# Altium schematic sheet STM32.SchDoc
size A; SheetNumber: 2; SheetTotal: 2; SPICEModelCachePQSWNAHP: <root> / <DocumentId>PQSWNAHP</DocumentId> / </root>
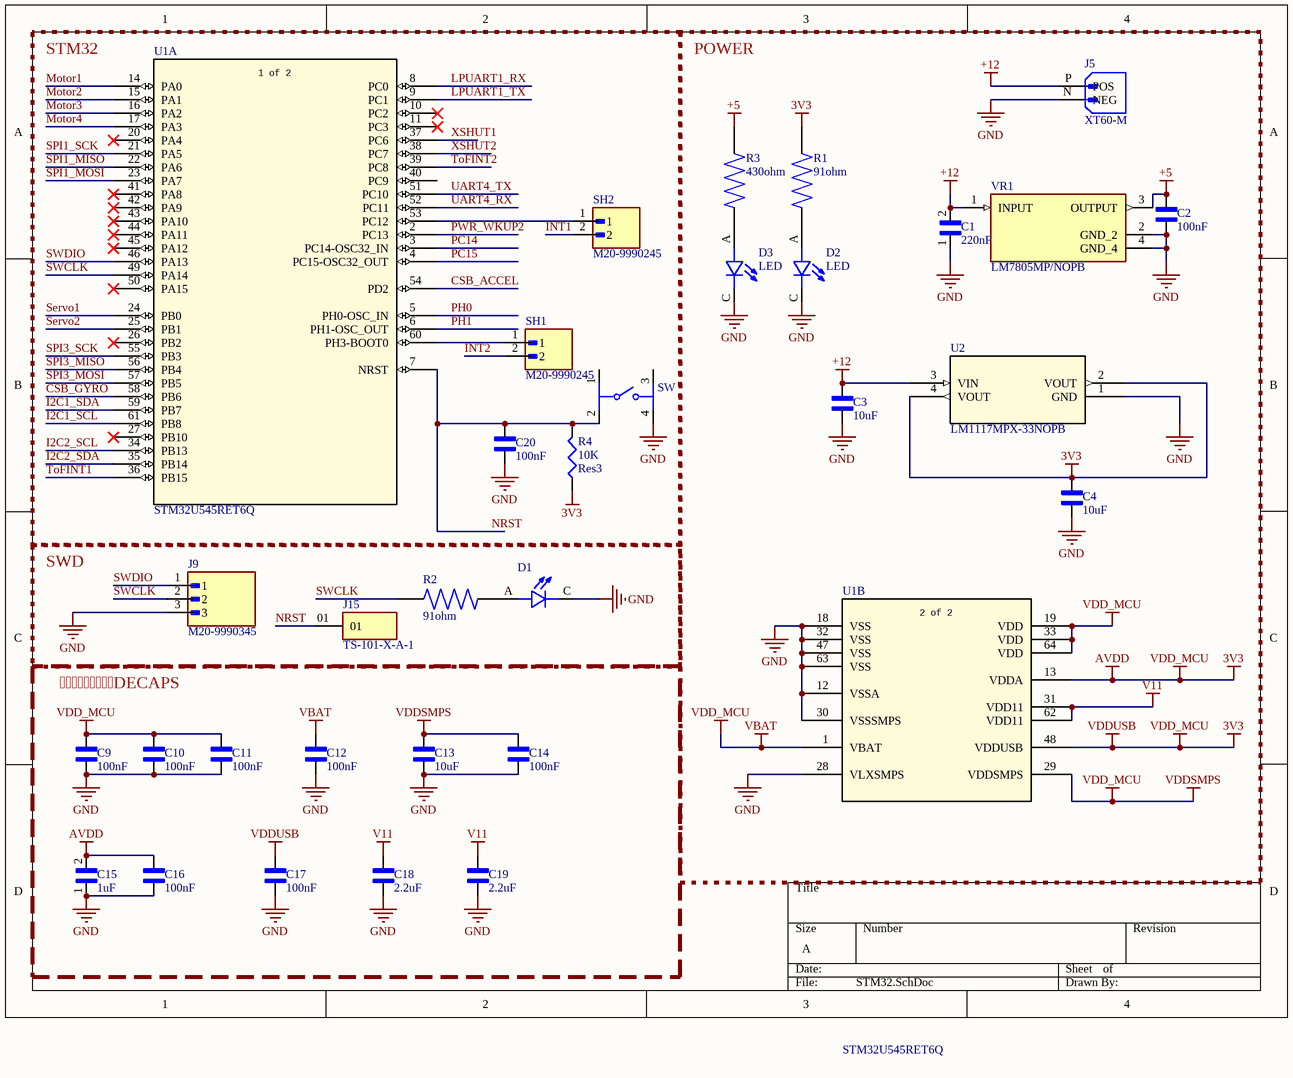
[diagram p0: STM32.SchDoc]

## Parts
C1  220nF  [CAPC2012X88N]
C2  100nF  [CAPC1608X90N]
C3  10uF  [CAPC2012X152N]
C4  10uF  [CAPC2012X152N]
C9  100nF  [CAPC1608X90N]
C10  100nF  [CAPC1608X90N]
C11  100nF  [CAPC1608X90N]
C12  100nF  [CAPC1608X90N]
C13  10uF  [CAPC2012X152N]
C14  100nF  [CAPC1608X90N]
C15  1uF  [CAPC3216X180N]
C16  100nF  [CAPC1608X90N]
C17  100nF  [CAPC1608X90N]
C18  2.2uF  [CAPC2012X152N]
C19  2.2uF  [CAPC2012X152N]
C20  100nF  [CAPC1608X90N]
D1  (no value)  [LED_MP-3014-1100-50-70]
D2  LED  [LED_MP-3014-1100-50-70]
D3  LED  [LED_MP-3014-1100-50-70]
J5  XT60-M  [AMASS_XT60-M]
J9  M20-9990345  [HARWIN_M20-9990345]
J15  TS-101-X-A-1  [SAMTEC_TS-101-X-A-1]
R1  91ohm  [RESC2012X50N]
R2  91ohm  [RESC2012X50N]
R3  430ohm  [RES_ERJ-6GEYJ431V]
R4  Res3  value 10K  [J1-0603]
SH1  M20-9990245  [HARWIN_M20-9990245]
SH2  M20-9990245  [HARWIN_M20-9990245]
SW  (no value)  [FP-2-1977223-2-MFG]
U1  STM32U545RET6Q  [LQFP64-10x10mm_STM]  (parts A,B of 2)
U2  LM1117MPX-33NOPB  [SOT-223_DIO]
VR1  LM7805MP/NOPB  [VREG_LM7805MP/NOPB]

## Blocks framed on the sheet
STM32: C20 R4 SH1 SH2 SW U1
POWER: C1-C4 D2 D3 J5 R1 R3 U1 U2 VR1
SWD: D1 J9 J15 R2
DECAPS: C9-C19

## Nets
3V3: C4.2 C9.2 C10.2 C11.2 C12.2 C13.2 C14.2 C15.2 C16.2 C17.2 R1.2 R4.1 U1.1(VBAT) U1.13(VDDA) U1.19(VDD) U1.29(VDDSMPS) U1.33(VDD) U1.48(VDDUSB) U1.64(VDD) U2.2(VOUT) U2.4(VOUT)  [also labelled AVDD, VBAT, VDD_MCU, VDDSMPS, VDDUSB]
+5: C2.2 R3.2 VR1.3(OUTPUT)
+12: C1.2 C3.2 J5.P(POS) U2.3(VIN) VR1.1(INPUT)
GND: C1.1 C2.1 C3.1 C4.1 C9.1 C10.1 C11.1 C12.1 C13.1 C14.1 C15.1 C16.1 C17.1 C18.1 C19.1 C20.1 D1.C D2.C D3.C J5.N(NEG) J9.3 SW.4 U1.12(VSSA) U1.18(VSS) U1.28(VLXSMPS) U1.30(VSSSMPS) U1.32(VSS) U1.47(VSS) U1.63(VSS) U2.1(GND) VR1.2(GND_2) VR1.4(GND_4)
V11: C18.2 C19.2 U1.31(VDD11) U1.62(VDD11)
CSB_ACCEL: U1.54(PD2)
CSB_GYRO: U1.58(PB6)
I2C1_SCL: U1.61(PB8)
I2C1_SDA: U1.59(PB7)
I2C2_SCL: U1.34(PB13)
I2C2_SDA: U1.35(PB14)
INT1: SH2.2
INT2: SH1.2
LPUART1_RX: U1.8(PC0)
LPUART1_TX: U1.9(PC1)
Motor1: U1.14(PA0)
Motor2: U1.15(PA1)
Motor3: U1.16(PA2)
Motor4: U1.17(PA3)
NRST: C20.2 J15.01 R4.2 SW.2 U1.7(NRST)
PC14: U1.3(PC14-OSC32_IN)
PC15: U1.4(PC15-OSC32_OUT)
PH0: U1.5(PH0-OSC_IN)
PH1: U1.6(PH1-OSC_OUT)
PWR_WKUP2: U1.2(PC13)
Servo1: U1.24(PB0)
Servo2: U1.25(PB1)
SPI1_MISO: U1.22(PA6)
SPI1_MOSI: U1.23(PA7)
SPI1_SCK: U1.21(PA5)
SPI3_MISO: U1.56(PB4)
SPI3_MOSI: U1.57(PB5)
SPI3_SCK: U1.55(PB3)
SWCLK: J9.2 R2.2 U1.49(PA14)
SWDIO: J9.1 U1.46(PA13)
ToFINT1: U1.36(PB15)
ToFINT2: U1.39(PC8)
UART4_RX: U1.52(PC11)
UART4_TX: U1.51(PC10)
XSHUT1: U1.37(PC6)
XSHUT2: U1.38(PC7)
NetD1_A: D1.A R2.1
NetD2_A: D2.A R1.1
NetD3_A: D3.A R3.1
NetSH1_1: SH1.1 U1.60(PH3-BOOT0)
NetSH2_1: SH2.1 U1.53(PC12)

Not connected (* = marked no-connect by the designer): SW 1 3; U1 10(PC2)* 11(PC3)* 20(PA4)* 26(PB2)* 27(PB10)* 40(PC9) 41(PA8)* 42(PA9)* 43(PA10)* 44(PA11)* 45(PA12)* 50(PA15)*

## Notes on the sheet
- (in symbol STM32U545RET6Q, part A) 1 of 2
- (in symbol STM32U545RET6Q, part B) 2 of 2

## Library data of the parts
C1 = C0805C224J4RACTU: .22UF 16V 5% 080; Package: None; Price: None; Value: *; MP: C0805C224J4RACTU; Availability: Unavailable
C2 C9-C12 C14 C16 C17 C20 = 06035C104K4T2A: Capacitor MLCC 0603 100nF 50V | AVX 06035C104K4T2A; SnapEDA_Link: https://www.snapeda.com/parts/06035C104K4T2A/AVX/view-part/?ref=snap; Package: 1608 AVX; Value: *; MF: AVX; MP: 06035C104K4T2A; Check_prices: https://www.snapeda.com/parts/06035C104K4T2A/AVX/view-part/?ref=eda
C3 C4 C13 = 0805ZC106KAT4A: 10 ÂµF Â±10% 10V Ceramic Capacitor X7R 0805 (2012 Metric); MF: AVX / Kyocera; SnapEDA_Link: https://www.snapeda.com/parts/0805ZC106KAT4A/AVX/view-part/?ref=snap; Package: 2012 AVX; Value: *; MP: 0805ZC106KAT4A; Check_prices: https://www.snapeda.com/parts/0805ZC106KAT4A/AVX/view-part/?ref=eda
C15 = CGA5L3X8R1H105K160AB: 1 ÂµF Â±10% 50V Ceramic Capacitor X8R 1206 (3216 Metric); MF: TDK; Package: 3216 TDK; Digi-Key_Part_Number: 445-13000-2-ND; Check_prices: https://www.snapeda.com/parts/CGA5L3X8R1H105K160AB/TDK/view-part/?ref=eda; Purchase-URL: https://pricing.snapeda.com/search/part/CGA5L3X8R1H105K160AB/?ref=eda; Value: *; MP: CGA5L3X8R1H105K160AB; SnapEDA_Link: https://www.snapeda.com/parts/CGA5L3X8R1H105K160AB/TDK/view-part/?ref=snap
C18 C19 = 08055C225KAT2A: 2.2 ÂµF Â±10% 50V Ceramic Capacitor X7R 0805 (2012 Metric); MF: AVX; SnapEDA_Link: https://www.snapeda.com/parts/08055C225KAT2A/AVX/view-part/?ref=snap; Package: 2012 AVX; Value: *; MP: 08055C225KAT2A; Check_prices: https://www.snapeda.com/parts/08055C225KAT2A/AVX/view-part/?ref=eda
D1-D3 = MP-3014-1100-50-70: LED Midpower Lighting series 3014 White,Cool, 5000K, 70 CRI, 34lm 2.85V 150mA 110Â°; MF: Luminus Devices Inc.; Package: NON-STANDARD-2 Luminus Devices Inc.; Check_prices: https://www.snapeda.com/parts/MP-3014-1100-50-70/Luminus+Devices+Inc./view-part/?ref=eda; Value: *; MP: MP-3014-1100-50-70; Availability: In Stock; SnapEDA_Link: https://www.snapeda.com/parts/MP-3014-1100-50-70/Luminus+Devices+Inc./view-part/?ref=snap; Purchase-URL: https://pricing.snapeda.com/search/part/MP-3014-1100-50-70/?ref=eda; Price: None
J5 = XT60-M: Plug; DC supply; XT60; male; PIN: 2; for cable; soldered; 30A; 500V; MF: AMASS; SnapEDA_Link: https://www.snapeda.com/parts/XT60-M/AMASS/view-part/?ref=snap; Package: Package; Value: *; MP: XT60-M; Check_prices: https://www.snapeda.com/parts/XT60-M/AMASS/view-part/?ref=eda
J9 = M20-9990345: 2.54mm (0.1) Pitch SIL Vertical Throughboard Pin Header, 6.1mm mating pin height, gold (hi-temp mould), 3 contacts; MF: Harwin; SnapEDA_Link: https://www.snapeda.com/parts/M20-9990345/Harwin+Inc./view-part/?ref=snap; Package: None; Value: *; MP: M20-9990345; Check_prices: https://www.snapeda.com/parts/M20-9990345/Harwin+Inc./view-part/?ref=eda
J15 = TS-101-X-A-1: 1 Position Header Connector Male Pin Gold; MF: Samtec Inc.; MP: TS-101-G-A-1; SnapEDA_Link: https://www.snapeda.com/parts/TS-101-G-A-1/Samtec+Inc./view-part/?ref=snap; Package: None; Value: *; Check_prices: https://www.snapeda.com/parts/TS-101-G-A-1/Samtec+Inc./view-part/?ref=eda
R1 R2 = CRCW080591R0FKEA: Surface Mount Thick Film Resistor, AEC-Q200 CRCW Series, 91 ohm, 125 mW, - 1%, 150 V; Package: None; Price: None; Value: *; MP: CRCW080591R0FKEA; Availability: Unavailable
R3 = ERJ-6GEYJ431V: MF: {'manufacturer': u'Panasonic Electronic Components'}; Package: None; Price: None; Value: *; MP: ERJ-6GEYJ431V; Availability: Unavailable
R4 = Res3: Resistor; Published: 8-Jun-2000; LatestRevisionDate: 29-May-2009; LatestRevisionNote: IPC-7351 Footprint Added.; PackageReference: J1-0603; Publisher: Altium Limited; PackageDescription: Chip Resistor
SH1 SH2 = M20-9990245: MF: Harwin; Package: None; Price: None; Value: *; MP: M20-9990245; Availability: Unavailable
SW = CMP-03407-000026-1: SWITCH TACTILE SPST-NO 0.05A 24V; RoHS Compliant: Yes
U1 = STM32U545RET6Q: Ultra-low-power with FPU Arm Cortex-M33 MCU with TrustZone, 160 MHz with 512 Kbytes of Flash memory; Manufacturer_Name: STMicroelectronics; Copyright: Copyright (C) 2025 Ultra Librarian. All rights reserved.; Manufacturer_Part_Number: STM32U545RET6Q; RefDes: RefDes; Type: Type
U2 = AP2114H-3.3TRG1: Description; Manufacturer_Name: Diodes Inc; Copyright: Copyright (C) 2025 Ultra Librarian. All rights reserved.; Manufacturer_Part_Number: AP2114H-3.3TRG1; RefDes: RefDes; Type: Type
VR1 = LM7805MP/NOPB: 1.5-A, 30-V, linear voltage regulator; MF: Texas Instruments; SnapEDA_Link: https://www.snapeda.com/parts/LM7805MP/NOPB/Texas+Instruments/view-part/?ref=snap; Package: SOT-223-4 Texas Instruments; Value: *; MP: LM7805MP/NOPB; Check_prices: https://www.snapeda.com/parts/LM7805MP/NOPB/Texas+Instruments/view-part/?ref=eda